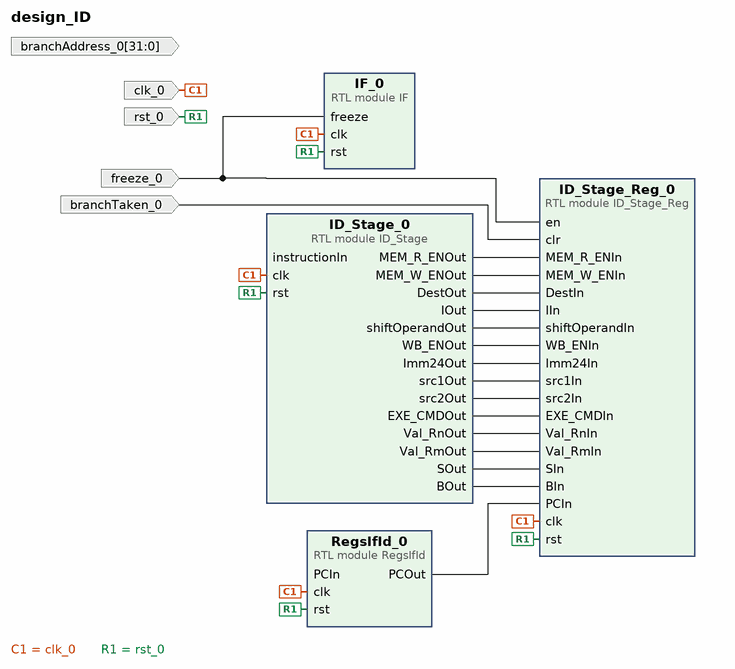
[diagram p0: block diagram of the top level]
# Vivado block design design_ID, xc7z010clg400-1, Vivado 2018.3
create_bd_design design_ID

create_bd_port -dir I -from 31 -to 0 branchAddress_0
create_bd_port -dir I branchTaken_0
create_bd_port -dir I -type clk clk_0
create_bd_port -dir I freeze_0
create_bd_port -dir I -type rst rst_0

create_bd_cell -type module -reference RegsIfId RegsIfId_0
create_bd_cell -type module -reference ID_Stage ID_Stage_0
create_bd_cell -type module -reference ID_Stage_Reg ID_Stage_Reg_0
create_bd_cell -type module -reference IF IF_0

# ---- connections ----

# net branchAddress_0_1 has one end: branchAddress_0
connect_bd_net -net branchTaken_0_1 [get_bd_ports branchTaken_0] [get_bd_pins ID_Stage_Reg_0/clr]
connect_bd_net -net clk_0_1 [get_bd_ports clk_0] \
  [get_bd_pins RegsIfId_0/clk] [get_bd_pins ID_Stage_0/clk] [get_bd_pins ID_Stage_Reg_0/clk] [get_bd_pins IF_0/clk]
connect_bd_net -net freeze_0_1 [get_bd_ports freeze_0] [get_bd_pins ID_Stage_Reg_0/en] [get_bd_pins IF_0/freeze]
connect_bd_net -net rst_0_1 [get_bd_ports rst_0] \
  [get_bd_pins RegsIfId_0/rst] [get_bd_pins ID_Stage_0/rst] [get_bd_pins ID_Stage_Reg_0/rst] [get_bd_pins IF_0/rst]
connect_bd_net [get_bd_pins ID_Stage_0/MEM_R_ENOut] [get_bd_pins ID_Stage_Reg_0/MEM_R_ENIn]
connect_bd_net [get_bd_pins ID_Stage_0/MEM_W_ENOut] [get_bd_pins ID_Stage_Reg_0/MEM_W_ENIn]
connect_bd_net [get_bd_pins ID_Stage_0/DestOut] [get_bd_pins ID_Stage_Reg_0/DestIn]
connect_bd_net [get_bd_pins ID_Stage_0/IOut] [get_bd_pins ID_Stage_Reg_0/IIn]
connect_bd_net [get_bd_pins ID_Stage_0/shiftOperandOut] [get_bd_pins ID_Stage_Reg_0/shiftOperandIn]
connect_bd_net [get_bd_pins ID_Stage_0/WB_ENOut] [get_bd_pins ID_Stage_Reg_0/WB_ENIn]
connect_bd_net [get_bd_pins ID_Stage_0/Imm24Out] [get_bd_pins ID_Stage_Reg_0/Imm24In]
connect_bd_net [get_bd_pins ID_Stage_0/src1Out] [get_bd_pins ID_Stage_Reg_0/src1In]
connect_bd_net [get_bd_pins ID_Stage_0/src2Out] [get_bd_pins ID_Stage_Reg_0/src2In]
connect_bd_net [get_bd_pins ID_Stage_0/EXE_CMDOut] [get_bd_pins ID_Stage_Reg_0/EXE_CMDIn]
connect_bd_net [get_bd_pins ID_Stage_0/Val_RnOut] [get_bd_pins ID_Stage_Reg_0/Val_RnIn]
connect_bd_net [get_bd_pins ID_Stage_0/Val_RmOut] [get_bd_pins ID_Stage_Reg_0/Val_RmIn]
connect_bd_net [get_bd_pins ID_Stage_0/SOut] [get_bd_pins ID_Stage_Reg_0/SIn]
connect_bd_net [get_bd_pins ID_Stage_0/BOut] [get_bd_pins ID_Stage_Reg_0/BIn]
# net RegsIfId_0_instructionOut has one end: ID_Stage_0/instructionIn
connect_bd_net [get_bd_pins RegsIfId_0/PCOut] [get_bd_pins ID_Stage_Reg_0/PCIn]
# net IF_0_PC has one end: RegsIfId_0/PCIn

validate_bd_design
save_bd_design
